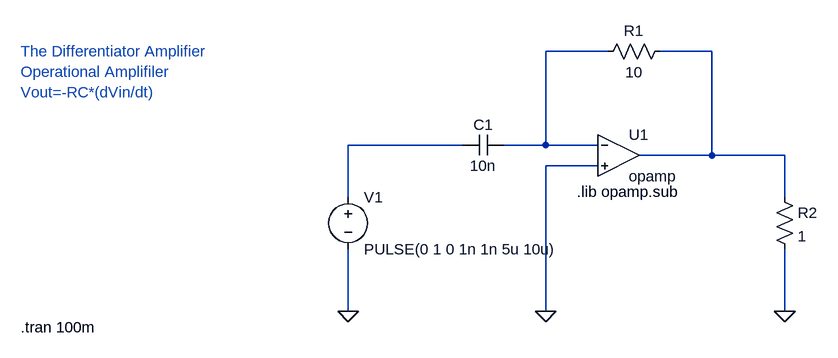
[diagram p0: schematic Differentiator Amp.asc]
Differentiator Amp.asc, the LTspice schematic file:
Version 4.1
SHEET 1 1624 680
WIRE 640 96 544 96
WIRE 800 96 720 96
WIRE 416 240 240 240
WIRE 544 240 544 96
WIRE 544 240 480 240
WIRE 624 240 544 240
WIRE 800 256 800 96
WIRE 800 256 688 256
WIRE 912 256 800 256
WIRE 624 272 544 272
WIRE 240 320 240 240
WIRE 912 320 912 256
WIRE 240 496 240 400
WIRE 544 496 544 272
WIRE 912 496 912 400
FLAG 240 496 0
FLAG 544 496 0
FLAG 912 496 0
SYMBOL voltage 240 304 R0
WINDOW 123 0 0 Left 0
WINDOW 39 0 0 Left 0
SYMATTR InstName V1
SYMATTR Value PULSE(0 1 0 1n 1n 5u 10u)
SYMBOL cap 480 224 R90
WINDOW 0 0 32 VBottom 2
WINDOW 3 32 32 VTop 2
SYMATTR InstName C1
SYMATTR Value 10n
SYMBOL res 736 80 R90
WINDOW 0 0 56 VBottom 2
WINDOW 3 32 56 VTop 2
SYMATTR InstName R1
SYMATTR Value 10
SYMBOL OpAmps\\opamp 656 192 R0
SYMATTR InstName U1
SYMBOL res 896 304 R0
SYMATTR InstName R2
SYMATTR Value 1
TEXT -264 96 Left 2 ;The Differentiator Amplifier\nOperational Amplifiler\nVout=-RC*(dVin/dt)
TEXT 592 312 Left 2 !.lib opamp.sub
TEXT -264 520 Left 2 !.tran 100m

The netlist it stands for:
* Differentiator Amp.asc
V1 N003 0 PULSE(0 1 0 1n 1n 5u 10u)
C1 N001 N003 10n
R1 N002 N001 10
X§U1 N001 0 N002 opamp Aol=100K GBW=10Meg  ; pins invin noninvin out
R2 N002 0 1
* The Differentiator Amplifier
* Operational Amplifiler
* Vout=-RC*(dVin/dt)
.lib opamp.sub
.tran 100m
.backanno
.end